# EAGLE design rbbb (EAGLE 7.4.0)
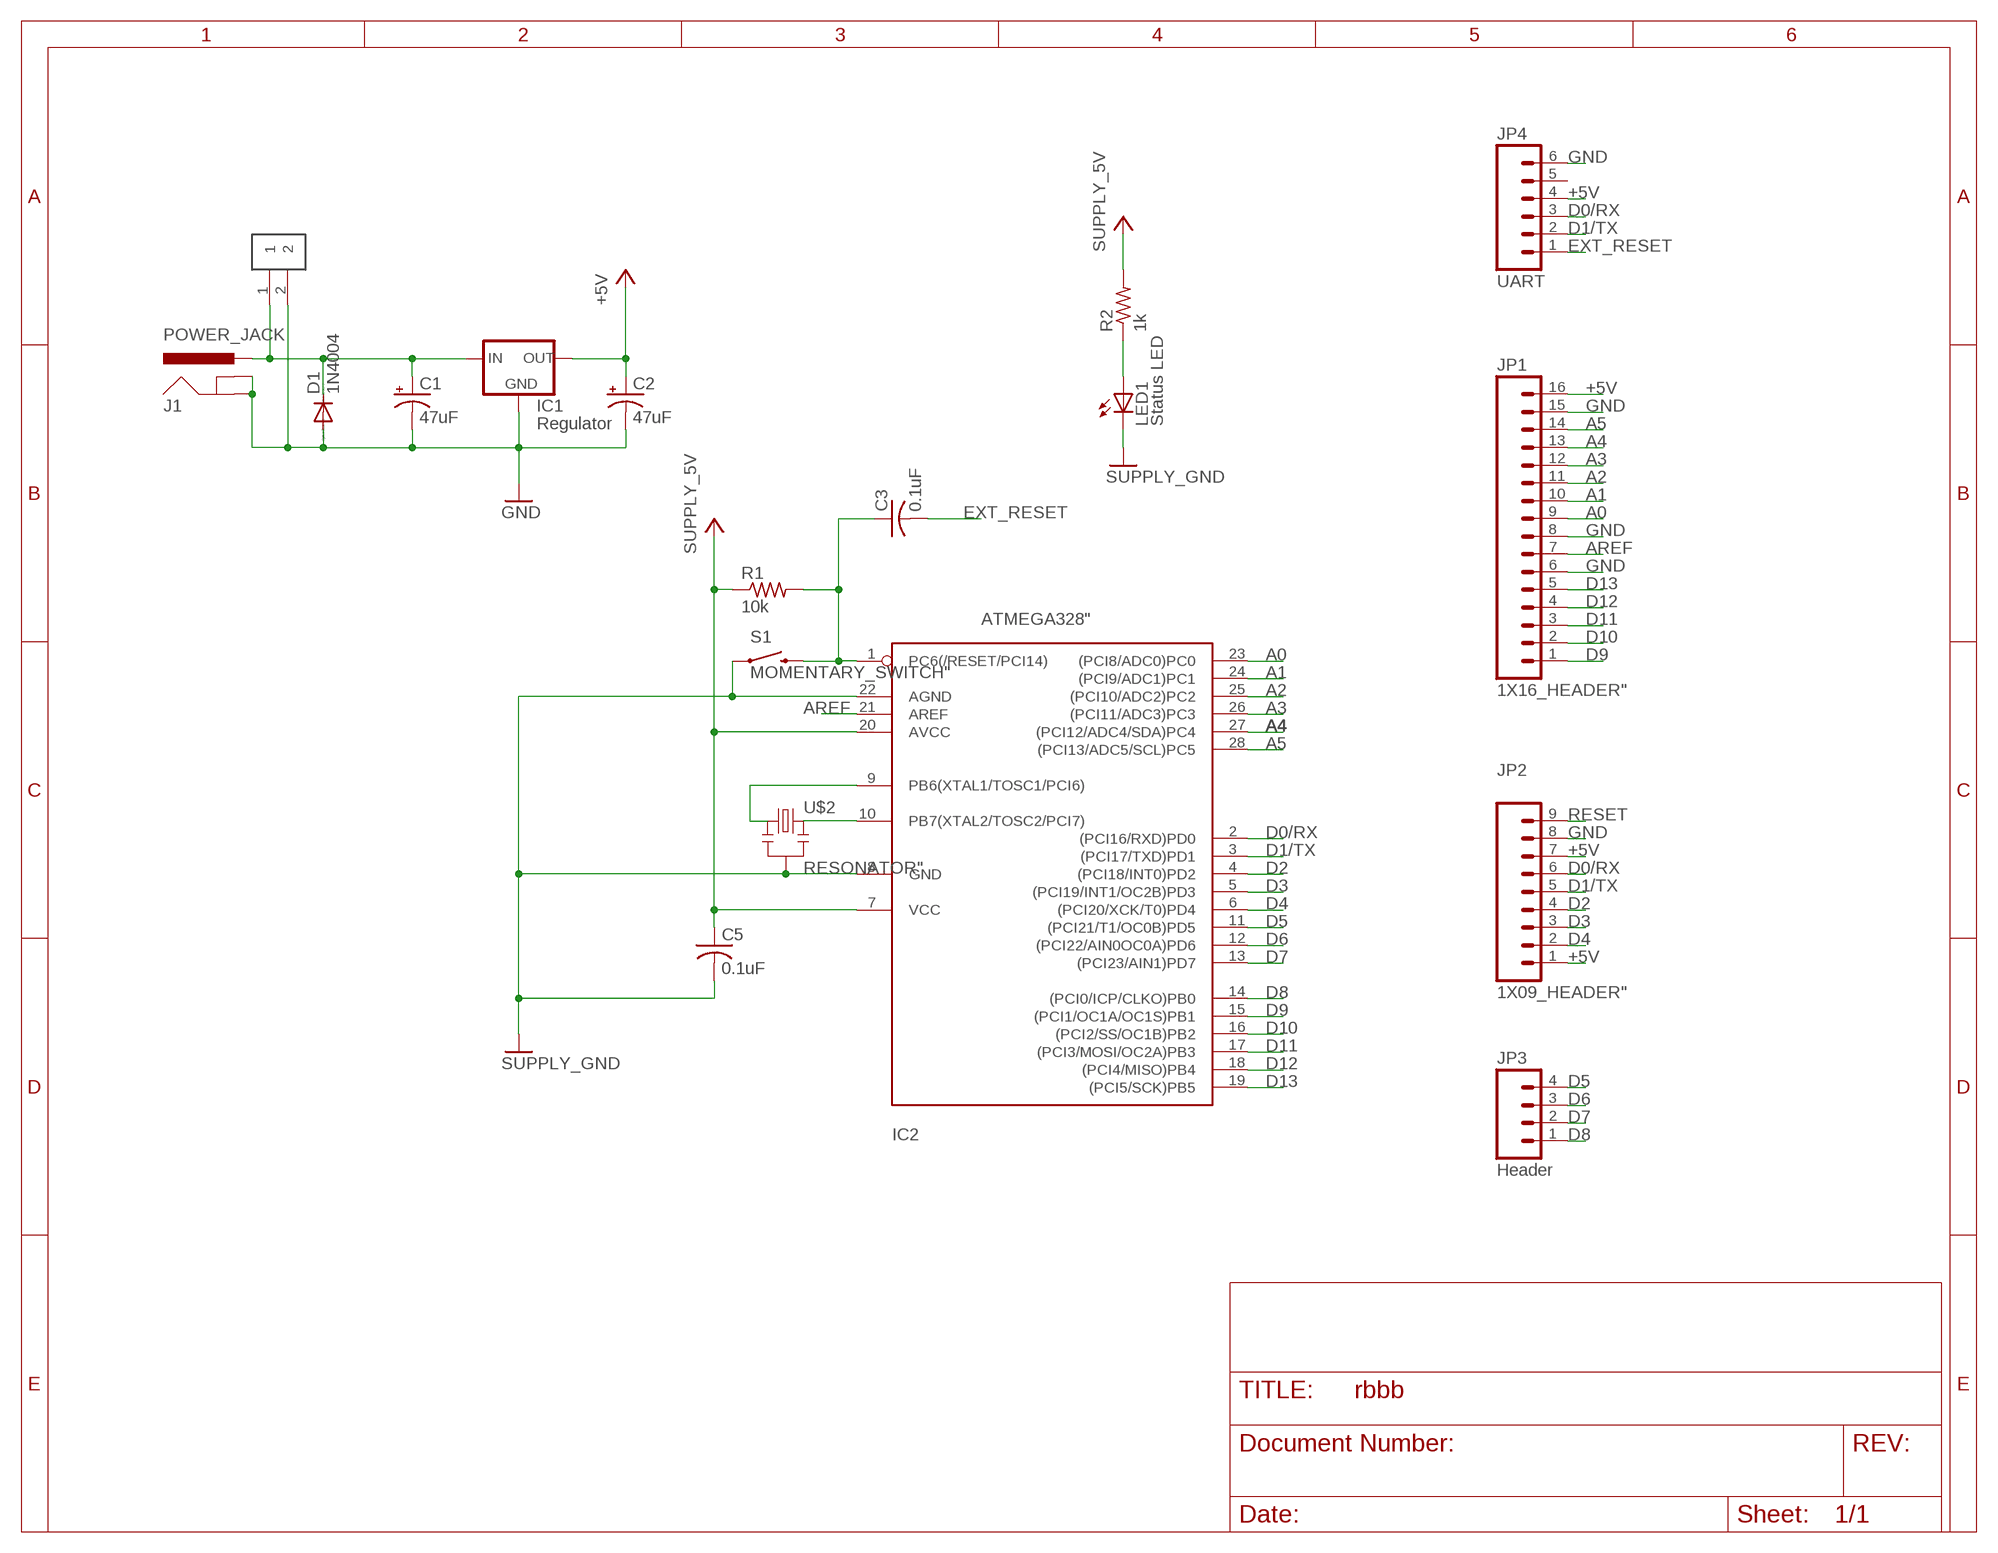
[diagram p0: schematic, sheet 1]

## Parts
C1  47uF  ELECTROLYTIC_CAP2.54MM  [ELECTROLYTIC_CAP]
C2  47uF  ELECTROLYTIC_CAP2.54MM  [ELECTROLYTIC_CAP]
C3  0.1uF  UNPOLARIZED_CAP"  [UNPOLARIZED_CAP]
C5  0.1uF  UNPOLARIZED_CAP"  [UNPOLARIZED_CAP]
D1  1N4004  [DO41-10]
IC1  Regulator  REGULATOR  [L4931_REGULATOR]
IC2  ATMEGA328"  [ATMEGA328]
J1  POWER_JACK  POWER_JACK"  [POWER_JACK]
JP1  1X16_HEADER"  [1X16_HEADER]
JP2  1X09_HEADER"  [1X09_HEADER]
JP3  Header  1X04_HEADER"  [1X04_HEADER]
JP4  UART  1X06_HEADER"  [1X06_HEADER]
LED1  Status LED  LED3MM  [LED]
R1  10k  RESISTOR1/6WATT  [RESISTOR]
R2  1k  RESISTOR1/6WATT  [RESISTOR]
S1  MOMENTARY_SWITCH"  [MOMENTARY_SWITCH]
U$1  1X02_HEADER  [1X02_HEADER]
U$2  RESONATOR"  [RESONATOR]

## Nets
+5V: C2.+ C5.1 IC1.OUT IC2.7(VCC) IC2.20(AVCC) JP1.16 JP2.1 JP2.7 JP4.4 R1.1 R2.2 ; supply symbol labelled SUPPLY_5V
A0: IC2.23((PCI8/ADC0)PC0) JP1.9
A1: IC2.24((PCI9/ADC1)PC1) JP1.10
A2: IC2.25((PCI10/ADC2)PC2) JP1.11
A3: IC2.26((PCI11/ADC3)PC3) JP1.12
A4: IC2.27((PCI12/ADC4/SDA)PC4) JP1.13
A5: IC2.28((PCI13/ADC5/SCL)PC5) JP1.14
AREF: IC2.21(AREF) JP1.7
D0/RX: IC2.2((PCI16/RXD)PD0) JP2.6 JP4.3
D1/TX: IC2.3((PCI17/TXD)PD1) JP2.5 JP4.2
D2: IC2.4((PCI18/INT0)PD2) JP2.4
D3: IC2.5((PCI19/INT1/OC2B)PD3) JP2.3
D4: IC2.6((PCI20/XCK/T0)PD4) JP2.2
D5: IC2.11((PCI21/T1/OC0B)PD5) JP3.4
D6: IC2.12((PCI22/AIN0OC0A)PD6) JP3.3
D7: IC2.13((PCI23/AIN1)PD7) JP3.2
D8: IC2.14((PCI0/ICP/CLKO)PB0) JP3.1
D9: IC2.15((PCI1/OC1A/OC1S)PB1) JP1.1
D10: IC2.16((PCI2/SS/OC1B)PB2) JP1.2
D11: IC2.17((PCI3/MOSI/OC2A)PB3) JP1.3
D12: IC2.18((PCI4/MISO)PB4) JP1.4
D13: IC2.19((PCI5/SCK)PB5) JP1.5
EXT_RESET: C3.2 JP4.1
GND: C1.- C2.- C5.2 D1.A IC1.GND IC2.8(GND) IC2.22(AGND) J1.GND J1.GNDBREAK JP1.6 JP1.8 JP1.15 JP2.8 JP4.6 LED1.K(C) S1.1 U$1.2 U$2.2 ; supply symbol labelled SUPPLY_GND
N$1: C1.+ D1.C IC1.IN J1.PWR U$1.1
N$2: LED1.A R2.1
N$3: C3.1 IC2.1(PC6(/RESET/PCI14)) R1.2 S1.3
N$5: IC2.10(PB7(XTAL2/TOSC2/PCI7)) U$2.3
N$6: IC2.9(PB6(XTAL1/TOSC1/PCI6)) U$2.1
RESET: JP2.9
Unconnected: JP4.5

## Library data of the parts
C1 C2 = RBBB:ELECTROLYTIC_CAP: POLARIZED CAPACITOR, American symbol
C3 C5 = RBBB:UNPOLARIZED_CAP: CAPACITOR, American symbol
D1 = diode:1N4004: DIODE general purpose rectifier, 1 A
IC1 = RBBB:REGULATOR: VOLTAGE REGULATOR
IC2 = RBBB:ATMEGA328: MICROCONTROLLER 16 kBytes FLASH 1 kBytes SRAM 512 Bytes EEPROM USART 8-channel 10 bit ADC
J1 = RBBB:POWER_JACK: Power Jack This is the standard 5.5mm barrel jack for power. The PTH is the most common, proven, reliable, footprint. All others are experimental. The Slot footprint only works if the mill layer is transmitted to the PCB fab house so be warned. Spark Fun Electronics SKU : PRT-00119. Mating wall wart : TOL-00298 (and others)
JP1 = RBBB:1X16_HEADER
JP2 = RBBB:1X09_HEADER: Header 9 Standard 9-pin 0.1" header. Use with straight break away headers (SKU : PRT-00116), right angle break away headers (PRT-00553), swiss pins (PRT-00743), machine pins (PRT-00117), and female headers (PRT-00115).
JP3 = RBBB:1X04_HEADER: Header 4 Standard 4-pin 0.1" header. Use with straight break away headers (SKU : PRT-00116), right angle break away headers (PRT-00553), swiss pins (PRT-00743), machine pins (PRT-00117), and female headers (PRT-00115). Molex polarized connector foot print use with SKU : PRT-08231 with associated crimp pins and housings.
JP4 = RBBB:1X06_HEADER
LED1 = RBBB:LED: LED OSRAM: - CHIPLED LG R971, LG N971, LY N971, LG Q971, LY Q971, LO R971, LY R971 LH N974, LH R974 LS Q976, LO Q976, LY Q976 LO Q996 - Hyper CHIPLED LW Q18S LB Q993, LB Q99A, LB R99A - SideLED LS A670, LO A670, LY A670, LG A670, LP A670 LB A673, LV A673, LT A673, LW A673 LH A674 LY A675 LS A676, LA A676, LO A676, LY A676, LW A676 LS A679, LY A679, LG A679 - Hyper Micro SIDELED® LS Y876, LA Y876, LO Y876, LY Y876 LT Y87S - SmartLED LW L88C, LW L88S LB L89C, LB L89S, LG L890 LS L89K, LO L89K, LY L89K LS L896, LA L896, LO L896, LY L896 - TOPLED LS T670, LO T670, LY T670, LG T670, LP T670 LSG T670, LSP T670, LSY T670, LOP T670, LYG T670 LG T671, LOG T671, LSG T671 LB T673, LV T673, LT T673, LW T673 LH T674 LS T676, LA T676, LO T676, LY T676, LB T676, LH T676, LSB T676, LW T676 LB T67C, LV T67C, LT T67C, LS T67K, LO T67K, LY T67K, LW E67C LS E67B, LA E67B, LO E67B, LY E67B, LB E67C, LV E67C, LT E67C LW T67C LS T679, LY T679, LG T679 LS T770, LO T770, LY T770, LG T770, LP T770 LB T773, LV T773, LT T773, LW T773 LH T774 LS E675, LA E675, LY E675, LS T675 LS T776, LA T776, LO T776, LY T776, LB T776 LHGB T686 LT T68C, LB T68C - Hyper Mini TOPLED® LB M676 - Mini TOPLED Santana® LG M470 LS M47K, LO M47K, LY M47K Source: http://www.osram.convergy.de LUXEON: - LUMILED® LXK2-PW12-R00, LXK2-PW12-S00, LXK2-PW14-U00, LXK2-PW14-V00 LXK2-PM12-R00, LXK2-PM12-S00, LXK2-PM14-U00 LXK2-PE12-Q00, LXK2-PE12-R00, LXK2-PE12-S00, LXK2-PE14-T00, LXK2-PE14-U00 LXK2-PB12-K00, LXK2-PB12-L00, LXK2-PB12-M00, LXK2-PB14-N00, LXK2-PB14-P00, LXK2-PB14-Q00 LXK2-PR12-L00, LXK2-PR12-M00, LXK2-PR14-Q00, LXK2-PR14-R00 LXK2-PD12-Q00, LXK2-PD12-R00, LXK2-PD12-S00 LXK2-PH12-R00, LXK2-PH12-S00 LXK2-PL12-P00, LXK2-PL12-Q00, LXK2-PL12-R00 Source: www.luxeon.com KINGBRIGHT: KA-3528ASYC Source: www.kingbright.com
R1 R2 = RBBB:RESISTOR: RESISTOR, American symbol
S1 = RBBB:MOMENTARY_SWITCH
U$1 = RBBB:1X02_HEADER
U$2 = RBBB:RESONATOR: Resonator Small SMD resonator. This is the itty bitty 10/20MHz resonators with built in caps. CSTCE10M0G55 and CSTCE20M0V53. Footprint has been reviewed closely but hasn t been tested yet.'

## Board
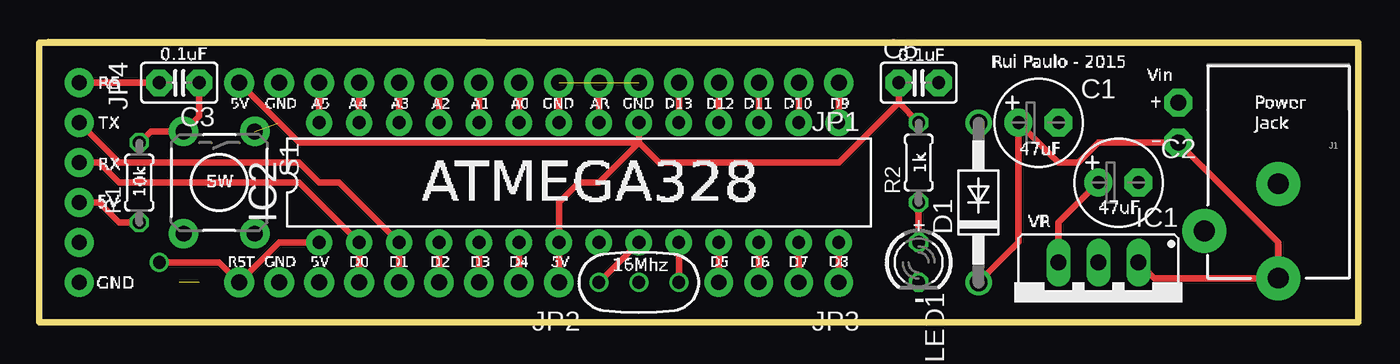
[diagram p1: board, top side]
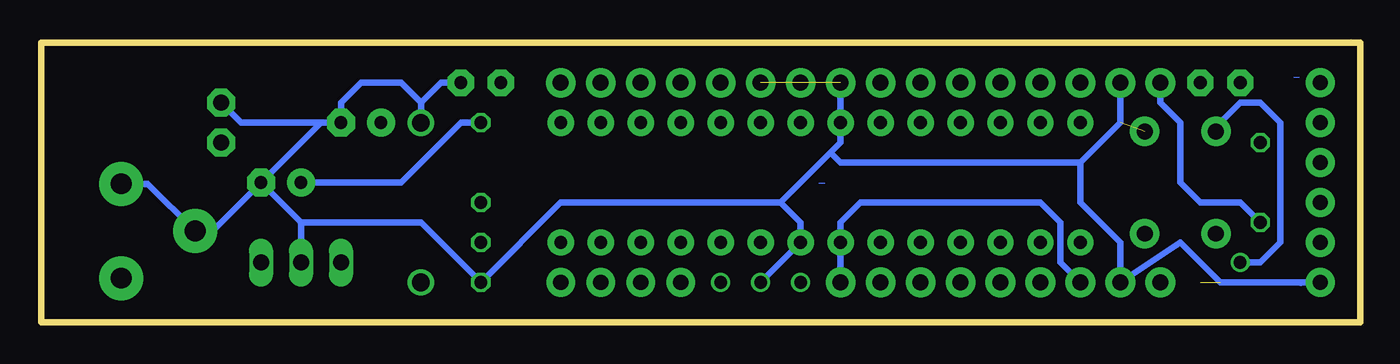
[diagram p2: board, bottom side, seen from below]

Size 83.94 x 18.13 mm. Coordinates in mm from the lower left corner, seen from the top.
Outline: 83.82,0.13 83.89,0 83.94,18.05 0.55,18.13 0,17.91
Outline: 0,17.91 0,0.13 83.82,0.13
Outline: 0,17.91 83.82,17.91 83.82,0.13
Copper layers (1*16): Top 0.0356mm / dielectric 1.5011mm / Bottom 0.0356mm
Design rules "LaenPCBOrder": minimum track width 6mil, minimum drill 13mil, track to track 6mil, track to pad 6mil, pad to pad 6mil, via to via 6mil, smd to smd 6mil, copper to edge 15mil, drill to drill 6mil, minimum pad ring 7mil, minimum via ring 7mil, stop-mask expansion 3mil, vias tented up to drill 0mil, thermal gap 10mil

### Footprints (pad centres in the part's own frame; a part is rotated, then mirrored left to right if it is on the bottom)
ELECTROLYTIC_CAP = drill 0.813 pad 1.778: + -1.27,0 | drill 0.813 pad 1.778 octagon: - 1.27,0
UNPOLARIZED_CAP = drill 0.813 pad 1.676 octagon: 1 -1.27,0; 2 1.27,0
DO41-10 = drill 1.118: A 5.08,0; C -5.08,0
L4931_REGULATOR = drill 1.016 long: GND 0,-2.54; IN -2.54,-2.54; OUT 2.54,-2.54
ATMEGA328 = drill 0.813 pad 1.676: 1 -16.51,-3.81; 2 -13.97,-3.81; 3 -11.43,-3.81; 4 -8.89,-3.81; 5 -6.35,-3.81; 6 -3.81,-3.81; 7 -1.27,-3.81; 8 1.27,-3.81; 9 3.81,-3.81; 10 6.35,-3.81; 11 8.89,-3.81; 12 11.43,-3.81; 13 13.97,-3.81; 14 16.51,-3.81; 15 16.51,3.81; 16 13.97,3.81; 17 11.43,3.81; 18 8.89,3.81; 19 6.35,3.81; 20 3.81,3.81; 21 1.27,3.81; 22 -1.27,3.81; 23 -3.81,3.81; 24 -6.35,3.81; 25 -8.89,3.81; 26 -11.43,3.81; 27 -13.97,3.81; 28 -16.51,3.81
POWER_JACK = drill 1.321 pad 2.794: GND 0,7.7; GNDBREAK 4.7,10.7; PWR 0,13.7
1X16_HEADER = drill 1.016 pad 1.88: 1 0,0; 2 2.54,0; 3 5.08,0; 4 7.62,0; 5 10.16,0; 6 12.7,0; 7 15.24,0; 8 17.78,0; 9 20.32,0; 10 22.86,0; 11 25.4,0; 12 27.94,0; 13 30.48,0; 14 33.02,0; 15 35.56,0; 16 38.1,0
1X09_HEADER = drill 1.016 pad 1.88: 1 0,0; 2 2.54,0; 3 5.08,0; 4 7.62,0; 5 10.16,0; 6 12.7,0; 7 15.24,0; 8 17.78,0; 9 20.32,0
1X04_HEADER = drill 0.965 pad 1.829: 1 0,0; 2 2.54,0; 3 5.08,0; 4 7.62,0
1X06_HEADER = drill 0.965 pad 1.829: 1 0,0; 2 2.54,0; 3 5.08,0; 4 7.62,0; 5 10.16,0; 6 12.7,0
LED = drill 0.813 octagon: A -1.27,0; K 1.27,0
RESISTOR = drill 0.813 octagon: 1 -2.54,0; 2 2.54,0
MOMENTARY_SWITCH = drill 1.016 pad 1.88: 1 -3.251,2.261; 2 3.251,2.261; 3 -3.251,-2.261; 4 3.251,-2.261
1X02_HEADER = drill 1.016 pad 1.778 octagon: 1 -1.27,0; 2 1.27,0
RESONATOR = drill 0.8: 1 -2.54,0; 2 0,0; 3 2.54,0

### Placement (x,y rotation side)
C1  63.5,12.83 0 top
C2  68.58,9.02 0 top
C3  8.89,15.37 180 top
C5  55.88,15.37 0 top
D1  59.69,7.75 90 top
IC1  67.31,1.4 180 top
IC2  34.29,9.02 0 top
J1  78.74,16.64 180 top
JP1  50.8,15.37 180 top
JP2  33.02,2.67 180 top
JP3  50.8,2.67 180 top
JP4  2.54,15.37 270 top
LED1  55.88,3.94 270 top
R1  6.35,9.02 90 top
R2  55.88,10.29 90 top
S1  11.43,9.02 270 top
U$1  72.39,12.83 90 top
U$2  38.1,2.67 0 top

### Tracks (layer width: path | path; a pad name or v marks a point on that pad's centre or on a via)
+5V
  Top 0.406: IC1.OUT 64.77,6.48 C2.+ | JP4.4 3.81,7.75 5.08,6.48 R1.1 | R2.2 54.61,14.1 | 54.61,14.1 C5.1 | IC2.20 38.1,11.56 | 38.1,11.56 39.37,10.29 50.8,10.29 54.61,14.1 | 38.1,11.56 35.56,9.02 34.29,9.02 33.02,7.75 IC2.7 JP2.1 | JP1.16 16.51,11.56 38.1,11.56
  Bottom 0.406: R2.2 57.15,12.83 60.96,9.02 C2.+ | JP2.1 33.02,6.48 31.75,7.75 20.32,7.75 19.05,6.48 19.05,3.94 JP2.7 | JP1.16 12.7,14.1 11.43,12.83 11.43,9.02 10.16,7.75 7.62,7.75 R1.1
A0
  Top 0.406: IC2.23 JP1.9
A1
  Top 0.406: IC2.24 JP1.10
A2
  Top 0.406: IC2.25 JP1.11
A3
  Top 0.406: IC2.26 JP1.12
A4
  Top 0.406: IC2.27 JP1.13
A5
  Top 0.406: IC2.28 JP1.14
AREF
  Top 0.406: JP1.7 IC2.21
D0/RX
  Top 0.406: JP2.6 IC2.2 16.51,9.02 5.08,9.02 3.81,10.29 JP4.3
D1/TX
  Top 0.406: JP2.5 IC2.3 19.05,9.02 17.78,9.02 16.51,10.29 5.08,10.29 JP4.2
D2
  Top 0.406: JP2.4 IC2.4
D3
  Top 0.406: JP2.3 IC2.5
D4
  Top 0.406: JP2.2 IC2.6
D5
  Top 0.406: IC2.11 JP3.4
D6
  Top 0.406: IC2.12 JP3.3
D7
  Top 0.406: IC2.13 JP3.2
D8
  Top 0.406: IC2.14 JP3.1
D9
  Top 0.406: JP1.1 IC2.15
D10
  Top 0.406: JP1.2 IC2.16
D11
  Top 0.406: JP1.3 IC2.17
D12
  Top 0.406: JP1.4 IC2.18
D13
  Top 0.406: JP1.5 IC2.19
EXT_RESET
  Top 0.406: C3.2 JP4.1
GND  (3 unrouted)
  Top 0.406: JP1.8 IC2.22
  Bottom 0.406: J1.GND 77.04,8.94 J1.GNDBREAK 72.93,5.94 C2.- | C2.- 67.31,6.48 | 67.31,6.48 IC1.GND | C2.- 66.04,12.83 C1.- | C1.- 71.12,12.83 U$1.2 | C1.- 64.77,14.1 63.5,15.37 60.96,15.37 59.69,14.1 | D1.A 59.69,14.1 | 59.69,14.1 58.42,15.37 C5.2 | 67.31,6.48 59.69,6.48 LED1.K 50.8,7.75 36.83,7.75 | U$2.2 IC2.8 35.56,6.48 36.83,7.75 | JP1.8 IC2.22 33.02,11.56 33.66,10.92 | 33.66,10.92 36.83,7.75 | JP1.15 15.24,12.83 17.78,10.29 | 17.78,10.29 33.02,10.29 33.66,10.92 | 17.78,10.29 17.78,7.75 15.24,5.21 JP2.8 11.43,5.21 8.89,2.67 JP4.6
N$1
  Top 0.406: IC1.IN 70.85,2.94 J1.PWR 78.74,5.21 U$1.1 67.31,11.56 66.04,10.29 64.77,10.29 C1.+ 62.23,5.21 D1.C
N$2
  Top 0.406: R2.1 LED1.A
N$3  (via drill 0.8)
  Top 0.406: IC2.1 15.24,5.21 12.7,2.67 11.43,3.94 v7.62,3.94 | C3.1 10.16,13.26 S1.3 7.06,12.27 R1.2
  Bottom 0.406: S1.3 9.17,12.55 7.62,14.1 6.35,14.1 5.08,12.83 5.08,5.21 6.35,3.94 v7.62,3.94
N$5
  Top 0.406: IC2.10 U$2.3
N$6
  Top 0.406: U$2.1 IC2.9
(copper drawn outside any net)
  shapes: Bottom area x3